# Altium schematic sheet Serial.SchDoc
size A4
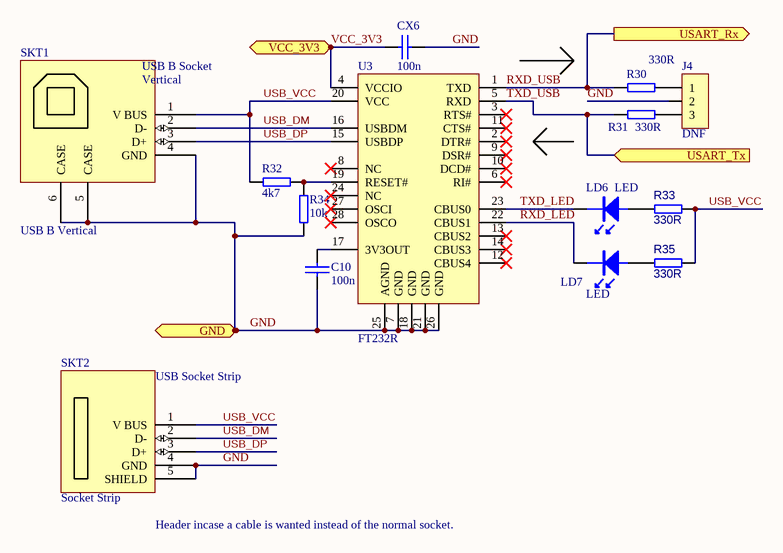
[diagram p0: Serial.SchDoc]

## Parts
C10  100n  [0603]
CX6  100n  [0603]
J4  DNF  [sip3]
LD6  LED  [LED3]
LD7  LED  [LED3]
R30  330R  [0603]
R31  330R  [0603]
R32  4k7  [0603]
R33  330R  [0603]
R34  10k  [0603]
R35  330R  [0603]
SKT1  USB B Vertical  [USB_B_Vertical]
SKT2  Socket Strip  [USB_SocketStrip]
U3  FT232R  [ssop28]

## Ports
GND (bidir), USART_Rx (out), USART_Tx (in), VCC_3V3 (in)

## Nets
GND: C10.1 CX6.1 J4.2 R34.1 SKT1.4(GND) SKT1.5(CASE) SKT1.6(CASE) SKT2.4(GND) SKT2.5(SHIELD) U3.7(GND) U3.18(GND) U3.21(GND) U3.25(AGND) U3.26(GND) ; port GND
RXD_LED: LD7.K U3.22(CBUS1)
RXD_USB: R30.2 U3.1(TXD) ; port USART_Rx
TXD_LED: LD6.K U3.23(CBUS0)
TXD_USB: R31.2 U3.5(RXD) ; port USART_Tx
USB_DM: SKT1.2(D-) SKT2.2(D-) U3.16(USBDM)
USB_DP: SKT1.3(D+) SKT2.3(D+) U3.15(USBDP)
USB_VCC: R32.1 R33.1 R35.1 SKT1.1(V_BUS) SKT2.1(V_BUS) U3.20(VCC)
VCC_3V3: CX6.2 U3.4(VCCIO) ; port VCC_3V3
NetC10_2: C10.2 U3.17(3V3OUT)
NetJ4_1: J4.1 R30.1
NetJ4_3: J4.3 R31.1
NetLD6_A: LD6.A R33.2
NetLD7_A: LD7.A R35.2
NetR32_2: R32.2 R34.2 U3.19(RESET#)

Not connected (* = marked no-connect by the designer): U3 2(DTR#)* 3(RTS#)* 6(RI#)* 8(NC)* 9(DSR#)* 10(DCD#)* 11(CTS#)* 12(CBUS4)* 13(CBUS2)* 14(CBUS3)* 24(NC)* 27(OSCI)* 28(OSCO)*

## Notes on the sheet
- (near SKT2) Header incase a cable is wanted instead of the normal socket.
- (in symbol USB_B_Vertical) USB B Socket; Vertical
- (in symbol USB_Pins) USB Socket Strip

## Library data of the parts
C10 CX6 = CAP
J4 = con3
R30 R31 = res8
R32-R35 = RES8
SKT1 = USB_B_Vertical: PartNo1: 732-2734-ND; Supplier1: Digi-Key; PartNo2: -; Supplier2: -
SKT2 = USB_Pins: Supplier1: N/A; Supplier2: N/A; PartNo1: N/A; PartNo2: N/A